# Altium schematic sheet 06-VOLTAGE_DETECTION.SchDoc
size A4
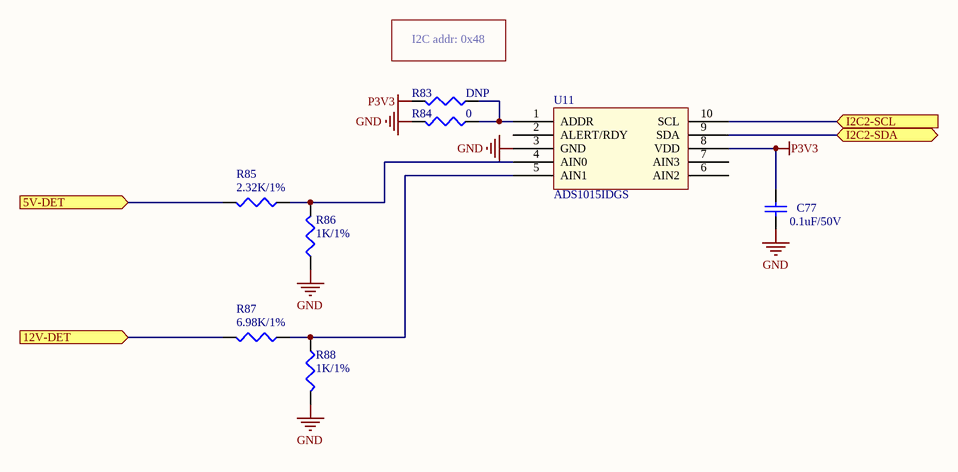
[diagram p0: 06-VOLTAGE_DETECTION.SchDoc]

## Parts
C77  0.1uF/50V  [0402]
R83  DNP  [0402]
R84  0  [0402]
R85  2.32K/1%  [0402]
R86  1K/1%  [0402]
R87  6.98K/1%  [0402]
R88  1K/1%  [0402]
U11  ADS1015IDGS  [VSSOP10]

## Ports
5V-DET (in), 12V-DET (in), I2C2-SCL (in), I2C2-SDA (bidir)

## Nets
GND: C77.2 R84.2 R86.1 R88.2 U11.3(GND)
P3V3: C77.1 R83.2 U11.8(VDD)
5V-DET: R85.2 ; port 5V-DET
12V-DET: R87.2 ; port 12V-DET
I2C2-SCL: U11.10(SCL) ; port I2C2-SCL
I2C2-SDA: U11.9(SDA) ; port I2C2-SDA
NetR83_1: R83.1 R84.1 U11.1(ADDR)
NetR85_1: R85.1 R86.2 U11.4(AIN0)
NetR87_1: R87.1 R88.1 U11.5(AIN1)

Not connected (* = marked no-connect by the designer): U11 2(ALERT/RDY) 6(AIN2) 7(AIN3)

## Notes on the sheet
- I2C addr: 0x48

## Library data of the parts
C77 = Cap: Capacitor; Published: 8-Jun-2000; LatestRevisionDate: 17-Jul-2002; LatestRevisionNote: Re-released for DXP Platform.; PackageReference: RAD-0.3; Publisher: Altium Limited; PackageDescription: Radial Cap, Thru-Hole; 2 Leads; 0.3 in Pin Spacing
R83-R88 = CR16-1003FM